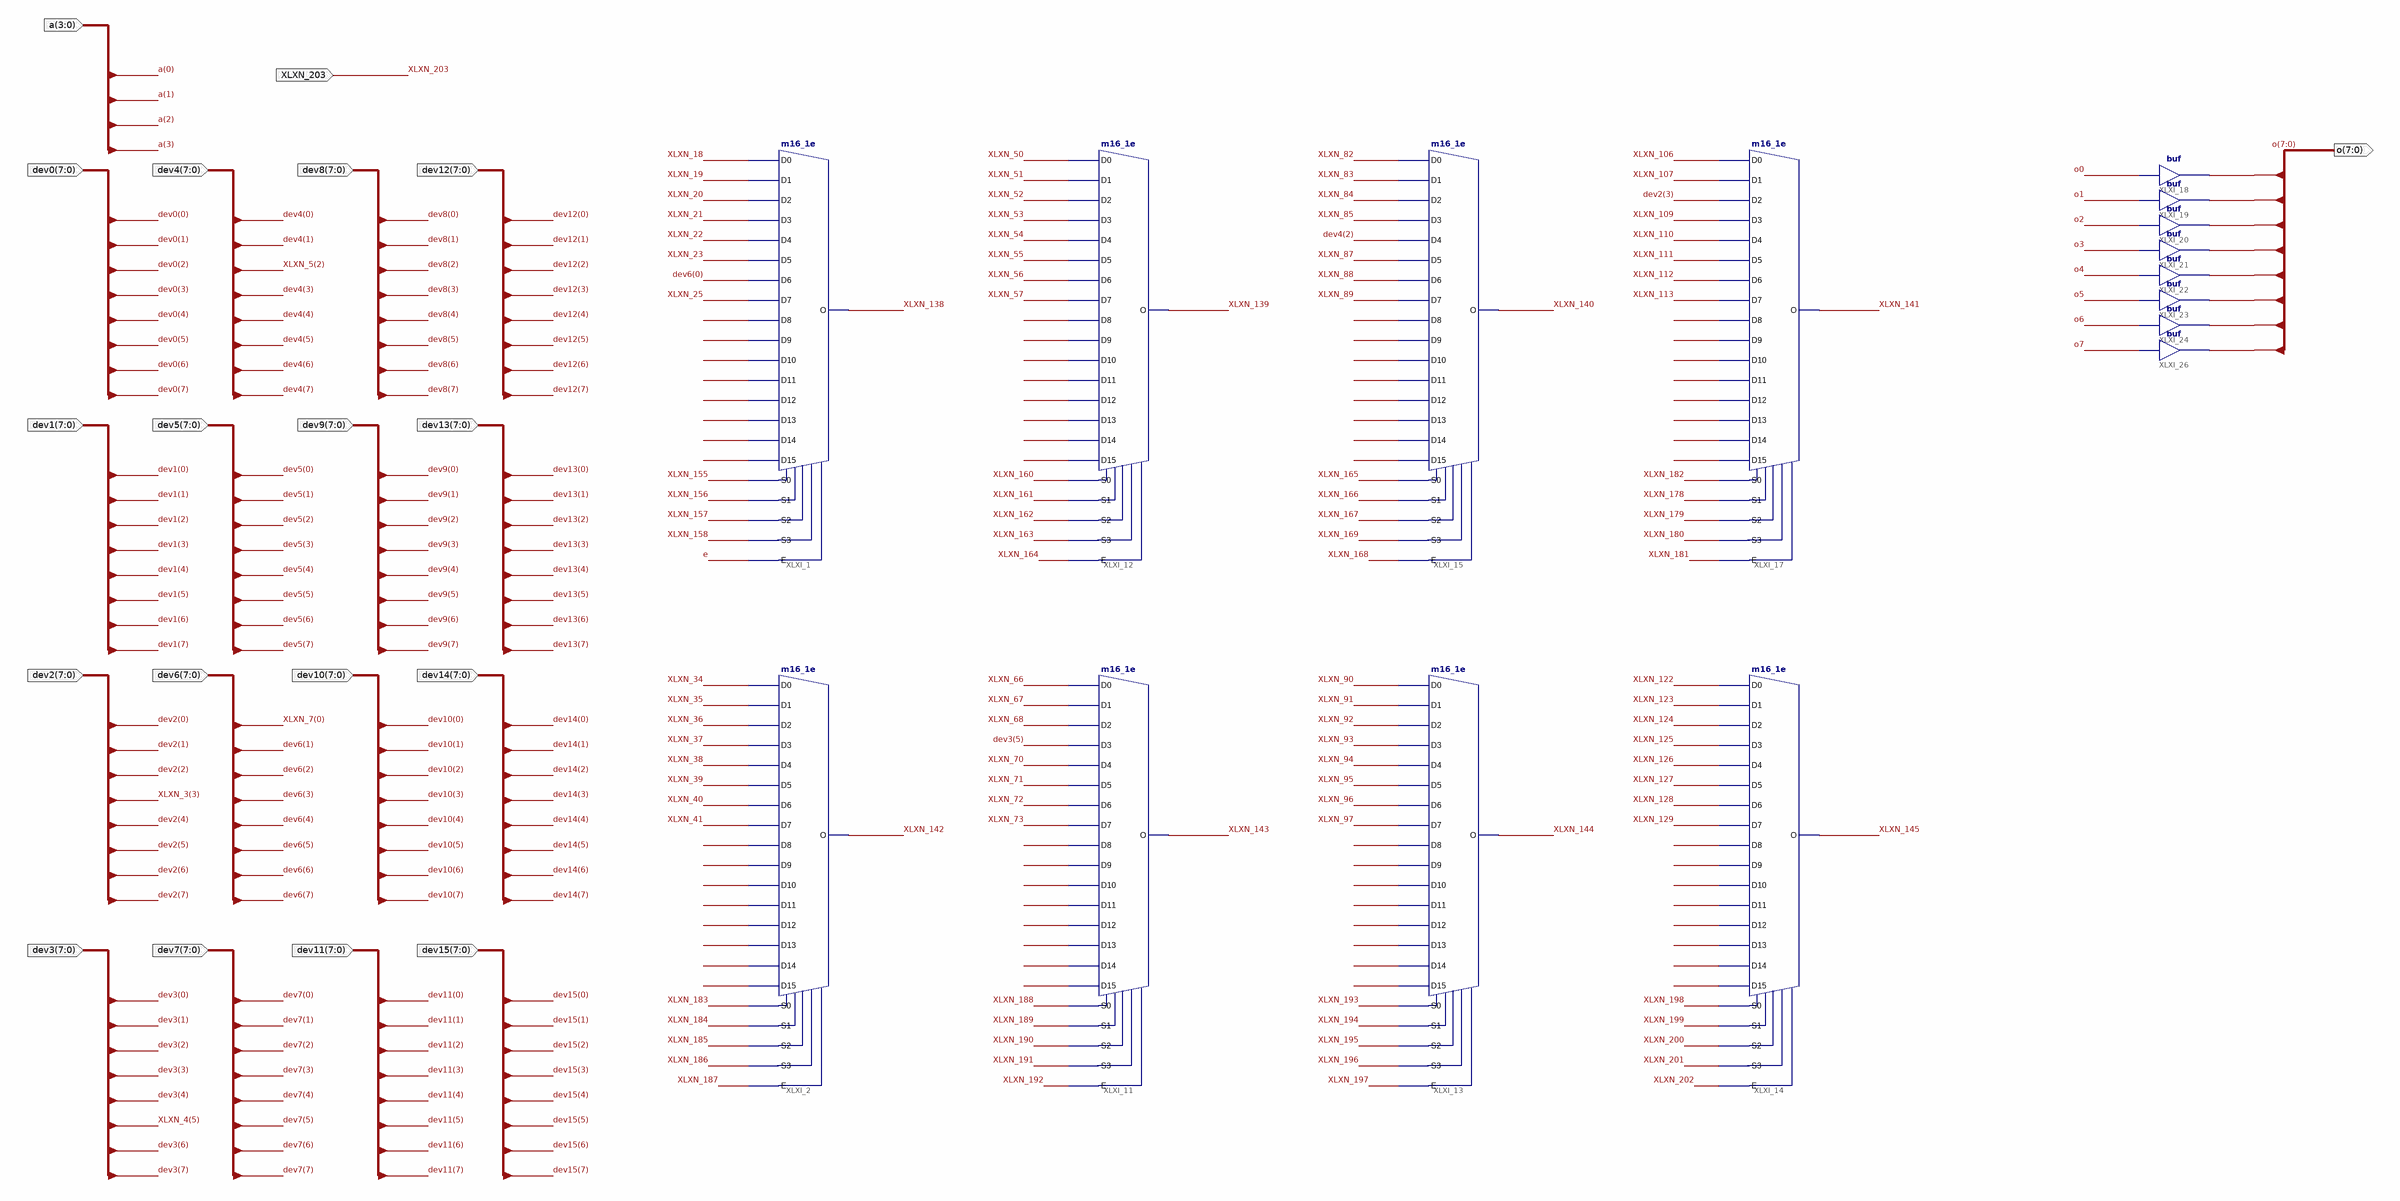
[diagram p0: schematic sheet 1]
// Xilinx ISE schematic mux8_32bit.sch (aspartan6) as structural Verilog: 16 symbols, 19 ports
module mux8_32bit (
  input  [7:0] dev0,
  input  [7:0] dev1,
  input  [7:0] dev2,
  input  [7:0] dev3,
  input  [7:0] dev4,
  input  [7:0] dev5,
  input  [7:0] dev6,
  input  [7:0] dev7,
  input  [7:0] dev8,
  input  [7:0] dev9,
  input  [7:0] dev10,
  input  [7:0] dev11,
  input  [7:0] dev12,
  input  [7:0] dev13,
  input  [7:0] dev14,
  input  [7:0] dev15,
  input  [3:0] a,
  input  XLXN_203,
  output [7:0] o
);

  wire e, o0, o1, o2, o3, o4, o5, o6, o7, XLXN_18, XLXN_19, XLXN_20, XLXN_21, XLXN_22, XLXN_23, XLXN_25,
       XLXN_26, XLXN_27, XLXN_28, XLXN_29, XLXN_30, XLXN_31, XLXN_32, XLXN_33, XLXN_34, XLXN_35, XLXN_36,
       XLXN_37, XLXN_38, XLXN_39, XLXN_40, XLXN_41, XLXN_42, XLXN_43, XLXN_44, XLXN_45, XLXN_46, XLXN_47,
       XLXN_48, XLXN_49, XLXN_50, XLXN_51, XLXN_52, XLXN_53, XLXN_54, XLXN_55, XLXN_56, XLXN_57, XLXN_58,
       XLXN_59, XLXN_60, XLXN_61, XLXN_62, XLXN_63, XLXN_64, XLXN_65, XLXN_66, XLXN_67, XLXN_68, XLXN_70,
       XLXN_71, XLXN_72, XLXN_73, XLXN_74, XLXN_75, XLXN_76, XLXN_77, XLXN_78, XLXN_79, XLXN_80, XLXN_81,
       XLXN_82, XLXN_83, XLXN_84, XLXN_85, XLXN_87, XLXN_88, XLXN_89, XLXN_90, XLXN_91, XLXN_92, XLXN_93,
       XLXN_94, XLXN_95, XLXN_96, XLXN_97, XLXN_98, XLXN_99, XLXN_100, XLXN_101, XLXN_102, XLXN_103,
       XLXN_104, XLXN_105, XLXN_106, XLXN_107, XLXN_109, XLXN_110, XLXN_111, XLXN_112, XLXN_113, XLXN_118,
       XLXN_119, XLXN_120, XLXN_121, XLXN_122, XLXN_123, XLXN_124, XLXN_125, XLXN_126, XLXN_127, XLXN_128,
       XLXN_129, XLXN_130, XLXN_131, XLXN_132, XLXN_133, XLXN_134, XLXN_135, XLXN_136, XLXN_137, XLXN_138,
       XLXN_139, XLXN_140, XLXN_141, XLXN_142, XLXN_143, XLXN_144, XLXN_145, XLXN_150, XLXN_151, XLXN_152,
       XLXN_153, XLXN_154, XLXN_155, XLXN_156, XLXN_157, XLXN_158, XLXN_160, XLXN_161, XLXN_162, XLXN_163,
       XLXN_164, XLXN_165, XLXN_166, XLXN_167, XLXN_168, XLXN_169, XLXN_170, XLXN_172, XLXN_173, XLXN_174,
       XLXN_175, XLXN_176, XLXN_177, XLXN_178, XLXN_179, XLXN_180, XLXN_181, XLXN_182, XLXN_183, XLXN_184,
       XLXN_185, XLXN_186, XLXN_187, XLXN_188, XLXN_189, XLXN_190, XLXN_191, XLXN_192, XLXN_193, XLXN_194,
       XLXN_195, XLXN_196, XLXN_197, XLXN_198, XLXN_199, XLXN_200, XLXN_201, XLXN_202;

  buf XLXI_18 (o[0], o0);
  buf XLXI_19 (o[1], o1);
  buf XLXI_20 (o[2], o2);
  buf XLXI_21 (o[3], o3);
  buf XLXI_22 (o[4], o4);
  buf XLXI_23 (o[5], o5);
  buf XLXI_24 (o[6], o6);
  buf XLXI_26 (o[7], o7);
  m16_1e XLXI_2 (
    .D0(XLXN_34), .D1(XLXN_35), .D10(XLXN_44), .D11(XLXN_45), .D12(XLXN_46), .D13(XLXN_47), .D14(XLXN_48),
    .D15(XLXN_49), .D2(XLXN_36), .D3(XLXN_37), .D4(XLXN_38), .D5(XLXN_39), .D6(XLXN_40), .D7(XLXN_41),
    .D8(XLXN_42), .D9(XLXN_43), .E(XLXN_187), .S0(XLXN_183), .S1(XLXN_184), .S2(XLXN_185), .S3(XLXN_186),
    .O(XLXN_142));
  m16_1e XLXI_1 (
    .D0(XLXN_18), .D1(XLXN_19), .D10(XLXN_28), .D11(XLXN_29), .D12(XLXN_30), .D13(XLXN_31), .D14(XLXN_32),
    .D15(XLXN_33), .D2(XLXN_20), .D3(XLXN_21), .D4(XLXN_22), .D5(XLXN_23), .D6(dev6[0]), .D7(XLXN_25),
    .D8(XLXN_26), .D9(XLXN_27), .E(e), .S0(XLXN_155), .S1(XLXN_156), .S2(XLXN_157), .S3(XLXN_158),
    .O(XLXN_138));
  m16_1e XLXI_11 (
    .D0(XLXN_66), .D1(XLXN_67), .D10(XLXN_76), .D11(XLXN_77), .D12(XLXN_78), .D13(XLXN_79), .D14(XLXN_80),
    .D15(XLXN_81), .D2(XLXN_68), .D3(dev3[5]), .D4(XLXN_70), .D5(XLXN_71), .D6(XLXN_72), .D7(XLXN_73),
    .D8(XLXN_74), .D9(XLXN_75), .E(XLXN_192), .S0(XLXN_188), .S1(XLXN_189), .S2(XLXN_190), .S3(XLXN_191),
    .O(XLXN_143));
  m16_1e XLXI_12 (
    .D0(XLXN_50), .D1(XLXN_51), .D10(XLXN_60), .D11(XLXN_61), .D12(XLXN_62), .D13(XLXN_63), .D14(XLXN_64),
    .D15(XLXN_65), .D2(XLXN_52), .D3(XLXN_53), .D4(XLXN_54), .D5(XLXN_55), .D6(XLXN_56), .D7(XLXN_57),
    .D8(XLXN_58), .D9(XLXN_59), .E(XLXN_164), .S0(XLXN_160), .S1(XLXN_161), .S2(XLXN_162), .S3(XLXN_163),
    .O(XLXN_139));
  m16_1e XLXI_13 (
    .D0(XLXN_90), .D1(XLXN_91), .D10(XLXN_100), .D11(XLXN_101), .D12(XLXN_102), .D13(XLXN_103),
    .D14(XLXN_104), .D15(XLXN_105), .D2(XLXN_92), .D3(XLXN_93), .D4(XLXN_94), .D5(XLXN_95), .D6(XLXN_96),
    .D7(XLXN_97), .D8(XLXN_98), .D9(XLXN_99), .E(XLXN_197), .S0(XLXN_193), .S1(XLXN_194), .S2(XLXN_195),
    .S3(XLXN_196), .O(XLXN_144));
  m16_1e XLXI_14 (
    .D0(XLXN_122), .D1(XLXN_123), .D10(XLXN_132), .D11(XLXN_133), .D12(XLXN_134), .D13(XLXN_135),
    .D14(XLXN_136), .D15(XLXN_137), .D2(XLXN_124), .D3(XLXN_125), .D4(XLXN_126), .D5(XLXN_127),
    .D6(XLXN_128), .D7(XLXN_129), .D8(XLXN_130), .D9(XLXN_131), .E(XLXN_202), .S0(XLXN_198), .S1(XLXN_199),
    .S2(XLXN_200), .S3(XLXN_201), .O(XLXN_145));
  m16_1e XLXI_17 (
    .D0(XLXN_106), .D1(XLXN_107), .D10(XLXN_152), .D11(XLXN_153), .D12(XLXN_154), .D13(XLXN_119),
    .D14(XLXN_120), .D15(XLXN_121), .D2(dev2[3]), .D3(XLXN_109), .D4(XLXN_110), .D5(XLXN_111), .D6(XLXN_112),
    .D7(XLXN_113), .D8(XLXN_150), .D9(XLXN_151), .E(XLXN_181), .S0(XLXN_182), .S1(XLXN_178), .S2(XLXN_179),
    .S3(XLXN_180), .O(XLXN_141));
  m16_1e XLXI_15 (
    .D0(XLXN_82), .D1(XLXN_83), .D10(XLXN_177), .D11(XLXN_176), .D12(XLXN_175), .D13(XLXN_174),
    .D14(XLXN_173), .D15(XLXN_172), .D2(XLXN_84), .D3(XLXN_85), .D4(dev4[2]), .D5(XLXN_87), .D6(XLXN_88),
    .D7(XLXN_89), .D8(XLXN_118), .D9(XLXN_170), .E(XLXN_168), .S0(XLXN_165), .S1(XLXN_166), .S2(XLXN_167),
    .S3(XLXN_169), .O(XLXN_140));
endmodule
